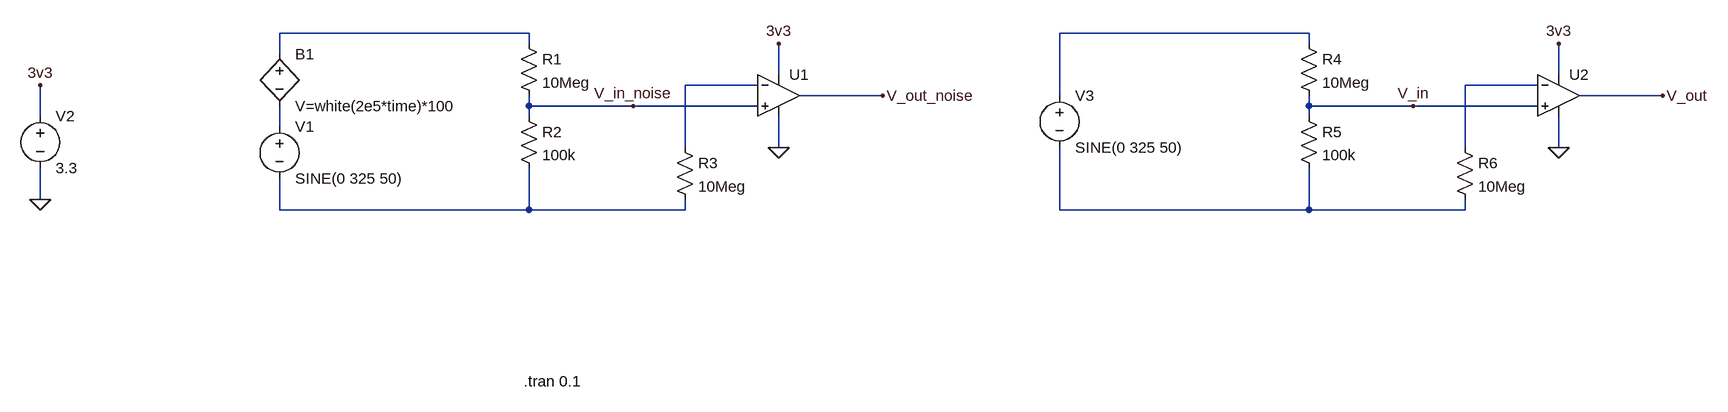
[diagram p0: schematic zcd-opamp.asc]
zcd-opamp.asc, the LTspice schematic file:
Version 4
SHEET 1 1608 680
WIRE -224 80 -608 80
WIRE 976 80 592 80
WIRE -224 96 -224 80
WIRE 976 96 976 80
WIRE -608 112 -608 80
WIRE 160 144 160 96
WIRE 1360 144 1360 96
WIRE 128 160 16 160
WIRE 1328 160 1216 160
WIRE 320 176 192 176
WIRE 592 176 592 80
WIRE 1520 176 1392 176
WIRE -224 192 -224 176
WIRE -64 192 -224 192
WIRE 128 192 -64 192
WIRE 976 192 976 176
WIRE 1136 192 976 192
WIRE 1328 192 1136 192
WIRE -976 208 -976 160
WIRE -224 208 -224 192
WIRE 976 208 976 192
WIRE -608 224 -608 192
WIRE 16 256 16 160
WIRE 160 256 160 208
WIRE 1216 256 1216 160
WIRE 1360 256 1360 208
WIRE -976 336 -976 288
WIRE -608 352 -608 304
WIRE -224 352 -224 288
WIRE -224 352 -608 352
WIRE 16 352 16 336
WIRE 16 352 -224 352
WIRE 592 352 592 256
WIRE 976 352 976 288
WIRE 976 352 592 352
WIRE 1216 352 1216 336
WIRE 1216 352 976 352
FLAG -976 160 3v3
FLAG 160 96 3v3
FLAG -976 336 0
FLAG 160 256 0
FLAG 1360 96 3v3
FLAG 1360 256 0
FLAG -64 192 V_in_noise
FLAG 1136 192 V_in
FLAG 320 176 V_out_noise
FLAG 1520 176 V_out
SYMBOL OpAmps\\UniversalOpamp2 160 176 R0
SYMATTR InstName U1
SYMATTR SpiceModel level2
SYMATTR Value2 Avol=1Meg GBW=1Meg Slew=600Meg
SYMATTR SpiceLine Ilimit=20m Rail=0 Vos=0.001 Phimargin=45
SYMBOL voltage -608 208 R0
WINDOW 123 0 0 Left 0
WINDOW 39 0 0 Left 0
SYMATTR InstName V1
SYMATTR Value SINE(0 325 50)
SYMBOL voltage -976 192 R0
WINDOW 123 0 0 Left 0
WINDOW 39 0 0 Left 0
SYMATTR InstName V2
SYMATTR Value 3.3
SYMBOL res -240 80 R0
SYMATTR InstName R1
SYMATTR Value 10Meg
SYMBOL res -240 192 R0
SYMATTR InstName R2
SYMATTR Value 100k
SYMBOL res 0 240 R0
SYMATTR InstName R3
SYMATTR Value 10Meg
SYMBOL bv -608 96 R0
SYMATTR InstName B1
SYMATTR Value V=white(2e5*time)*100
SYMBOL OpAmps\\UniversalOpamp2 1360 176 R0
SYMATTR InstName U2
SYMATTR SpiceModel level2
SYMATTR Value2 Avol=100k GBW=1Meg Slew=600k
SYMATTR SpiceLine Ilimit=20m Rail=0 Vos=0.001 Phimargin=45
SYMBOL voltage 592 160 R0
WINDOW 123 0 0 Left 0
WINDOW 39 0 0 Left 0
SYMATTR InstName V3
SYMATTR Value SINE(0 325 50)
SYMBOL res 960 80 R0
SYMATTR InstName R4
SYMATTR Value 10Meg
SYMBOL res 960 192 R0
SYMATTR InstName R5
SYMATTR Value 100k
SYMBOL res 1200 240 R0
SYMATTR InstName R6
SYMATTR Value 10Meg
TEXT -232 616 Left 2 !.tran 0.1

The netlist it stands for:
* zcd-opamp.asc
XU1 V_in_noise N003 3v3 0 V_out_noise level2 Avol=1Meg GBW=1Meg Slew=600Meg Ilimit=20m Rail=0 Vos=0.001 Phimargin=45 En=0 Enk=0 In=0 Ink=0 Rin=500Meg  ; pins In+ In- V+ V- OUT
V1 N005 N006 SINE(0 325 50)
V2 3v3 0 3.3
R1 N001 V_in_noise 10Meg
R2 V_in_noise N006 100k
R3 N003 N006 10Meg
B1 N001 N005 V=white(2e5*time)*100
XU2 V_in N004 3v3 0 V_out level2 Avol=100k GBW=1Meg Slew=600k Ilimit=20m Rail=0 Vos=0.001 Phimargin=45 En=0 Enk=0 In=0 Ink=0 Rin=500Meg  ; pins In+ In- V+ V- OUT
V3 N002 N007 SINE(0 325 50)
R4 N002 V_in 10Meg
R5 V_in N007 100k
R6 N004 N007 10Meg
.tran 0.1
.lib UniversalOpAmp2.lib
.backanno
.end